# Altium schematic sheet I2C-Repeater.SchDoc: I2C Repeater for RadFET
size A4; CheckedBy: (not checked); Author: P. Kuligowski
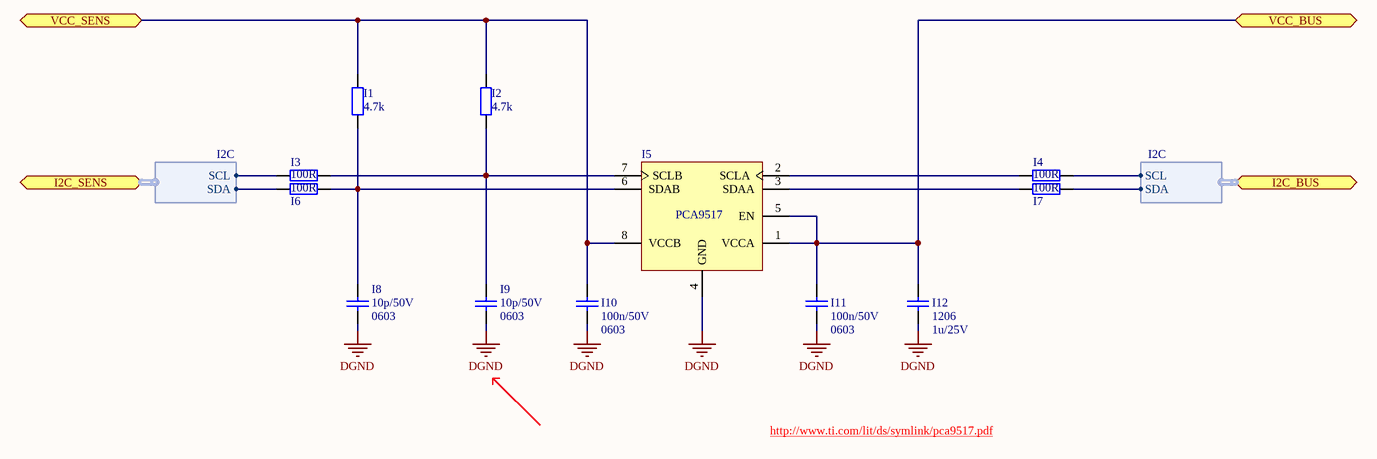
[diagram p0: I2C-Repeater.SchDoc]

## Parts
I1  4.7k  [SMD_Resistor_0603]
I2  4.7k  [SMD_Resistor_0603]
I3  100R  [SMD_Resistor_0603]
I4  100R  [SMD_Resistor_0603]
I5  PCA9517  [TSSOP8_L]
I6  100R  [SMD_Resistor_0603]
I7  100R  [SMD_Resistor_0603]
I8  Package: 0603  [SMD_Capacitor_0603]  (hidden comment: 10p/50V)
I9  Package: 0603  [SMD_Capacitor_0603]  (hidden comment: 10p/50V)
I10  Package: 0603  [SMD_Capacitor_0603]  (hidden comment: 100n/50V)
I11  Package: 0603  [SMD_Capacitor_0603]  (hidden comment: 100n/50V)
I12  Package: 1206  [SMD_Capacitor_1206]  (hidden comment: 1u/25V)

## Ports
I2C_BUS (harness I2C), I2C_SENS (harness I2C), VCC_BUS, VCC_SENS

## Harnesses
I2C: SDA, SCL

## Nets
DGND: I5.4(GND) I8.2 I9.2 I10.1 I11.1 I12.1
VCC_BUS: I5.1(VCCA) I5.5(EN) I11.2 I12.2 ; port VCC_BUS
VCC_SENS: I1.2 I2.2 I5.8(VCCB) I10.2 ; port VCC_SENS
NetI1_1: I1.1 I5.6(SDAB) I6.2 I8.1
NetI2_1: I2.1 I3.2 I5.7(SCLB) I9.1
NetI3_1: I3.1 ; port I2C_SENS.SCL
NetI4_1: I4.1 ; port I2C_BUS.SCL
NetI4_2: I4.2 I5.2(SCLA)
NetI5_3: I5.3(SDAA) I7.2
NetI6_1: I6.1 ; port I2C_SENS.SDA
NetI7_1: I7.1 ; port I2C_BUS.SDA

## Notes on the sheet
- http://www.ti.com/lit/ds/symlink/pca9517.pdf
- Title:
- Project:
- Author:
- Model:
- Document Number:
- Checked by:
- Rev:
- Date:
- Approved by:
- Sheet:
- of
- File name:

## Library data of the parts
I1-I4 I6 I7 = Res: Package: 0603
  I1 I2: Value: 4.7k
  I3 I4 I6 I7: Value: 100R
I5 = PCA9517: Level-Translating I2C Bus Repeater; Manufacturer: Texas Instruments; ManufacturerPartNumber: PCA9517
I8 I9 = Cer_GCM1885C1H100JA16D: Ceramic Cap Murata Automotive 10p/50V C0G 0603; Manufacturer: Murata; ManufacturerPartNumber: GCM1885C1H100JA16D; Value: 10p/50V
I10 I11 = Cer_C0603T104K5RALTU: Ceramic Cap Kemet COTS 100n/50V X7R 0603; Manufacturer: Kemet; ManufacturerPartNumber: C0603T104K5RALTU; Value: 100n/50V
I12 = Cer_C1206T105K3RALTU: Ceramic Cap Kemet COTS 1u/25V X7R 1206; ManufacturerPartNumber: C1206T105K3RALTU; Manufacturer: Kemet; Value: 1u/25V